# Altium schematic sheet Barometer.SchDoc
size A; SheetNumber: 9
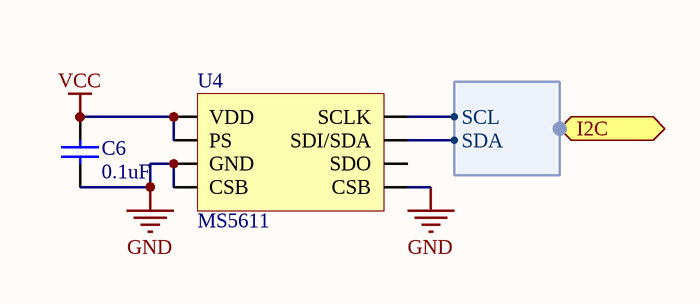
[diagram p0: Barometer.SchDoc]

## Parts
C6  value 0.1uF  [C0402[1005X55]]  (hidden comment: 0.1uF 6.3V 0402)
U4  MS5611  [MS5611]

## Ports
I2C (harness I2C)

## Harnesses
I2C: SCL, SDA

## Nets
GND: C6.1 U4.3(GND) U4.4(CSB) U4.5(CSB)
VCC: C6.2 U4.1(VDD) U4.2(PS)
NetU4_7: U4.7(SDI/SDA) ; port I2C.SDA
NetU4_8: U4.8(SCLK) ; port I2C.SCL

Not connected (* = marked no-connect by the designer): U4 6(SDO)

## Library data of the parts
C6 = CAP_0.1uF_6.3V_0402_10%: 0.1uF 6.3V 10% 0402 (1005 Metric); PartNumber: GRM155R70J104KA01D; Manufacturer: Murata; Tolerance: 10%; Mounting Technology: Surface Mount; PackageReference: 0402; PackageDescription: 0402 (1005 Metric); Voltage: 6.3V